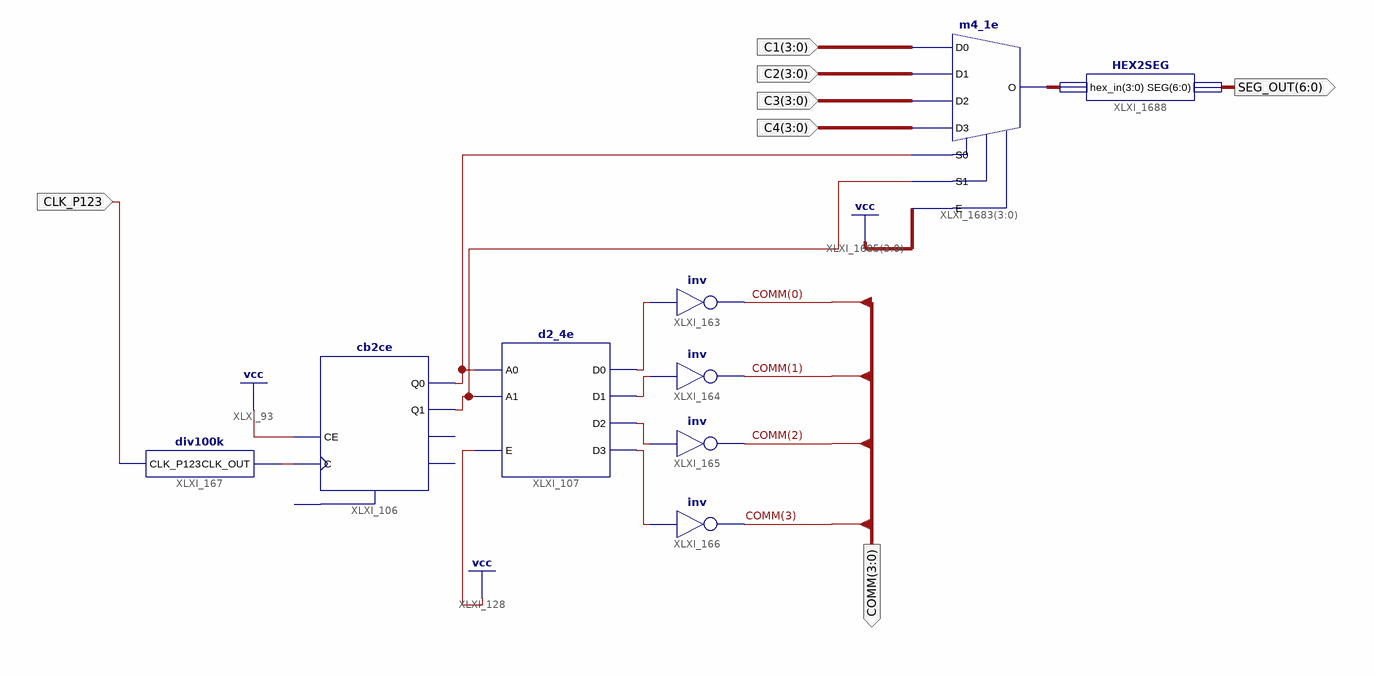
[diagram p0: schematic sheet 1]
// Xilinx ISE schematic segment_upgrade.sch (spartan6) as structural Verilog: 9 symbols, 7 ports
module segment_upgrade (
  input  CLK_P123,
  input  [3:0] C2,
  input  [3:0] C1,
  input  [3:0] C3,
  input  [3:0] C4,
  output [6:0] SEG_OUT,
  output [3:0] COMM
);

  wire qweqwe, qweqweqw, XLXN_423, XLXN_499, XLXN_502, XLXN_503, XLXN_504;
  wire [3:0] XLXN_523;

  cb2ce XLXI_106 (.C(XLXN_423), .CE(1'b1), .Q0(qweqwe), .Q1(qweqweqw));  // open: CLR, CEO, TC
  d2_4e XLXI_107 (.A0(qweqwe), .A1(qweqweqw), .E(1'b1), .D0(XLXN_499), .D1(XLXN_502), .D2(XLXN_503), .D3(XLXN_504));
  not XLXI_163 (COMM[0], XLXN_499);
  not XLXI_164 (COMM[1], XLXN_502);
  not XLXI_165 (COMM[2], XLXN_503);
  not XLXI_166 (COMM[3], XLXN_504);
  div100k XLXI_167 (.CLK_P123(CLK_P123), .CLK_OUT(XLXN_423));
  m4_1e XLXI_1683[3:0] (.D0(C1), .D1(C2), .D2(C3), .D3(C4), .E(4'b1111), .S0(qweqwe), .S1(qweqweqw), .O(XLXN_523));
  HEX2SEG XLXI_1688 (.hex_in(XLXN_523), .SEG(SEG_OUT));
endmodule
